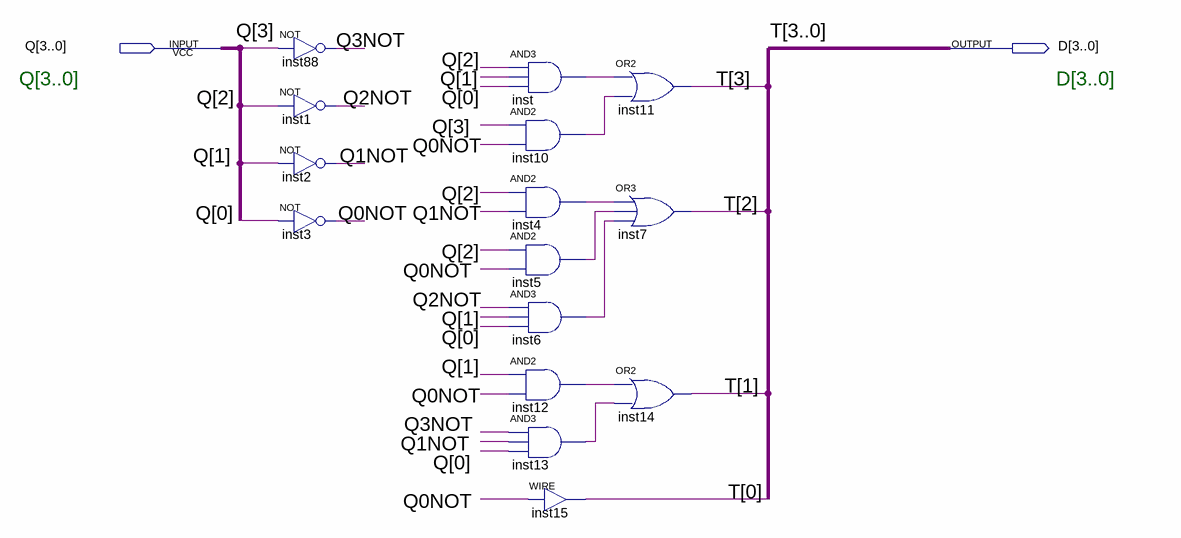
[diagram p0: schematic sheet]
// Quartus schematic TTKT.bdf as structural Verilog: 15 symbols, 2 pins
module TTKT (
  input  [3:0] Q,
  output [3:0] D
);

  wire inst4_out, inst5_out, inst6_out, inst10_out, inst12_out, inst13_out, inst_out, Q0NOT, Q1NOT, Q2NOT,
       Q3NOT;

  not inst88 (Q3NOT, Q[3]);
  not inst1 (Q2NOT, Q[2]);
  not inst2 (Q1NOT, Q[1]);
  not inst3 (Q0NOT, Q[0]);
  and inst (inst_out, Q[2], Q[1], Q[0]);
  and inst10 (inst10_out, Q[3], Q0NOT);
  and inst4 (inst4_out, Q[2], Q1NOT);
  and inst5 (inst5_out, Q[2], Q0NOT);
  and inst6 (inst6_out, Q2NOT, Q[1], Q[0]);
  and inst12 (inst12_out, Q[1], Q0NOT);
  and inst13 (inst13_out, Q3NOT, Q1NOT, Q[0]);
  assign D[0] = Q0NOT;  // WIRE inst15
  or inst11 (D[3], inst_out, inst10_out);
  or inst7 (D[2], inst4_out, inst5_out, inst6_out);
  or inst14 (D[1], inst12_out, inst13_out);

  // Other names for the same wires on the sheet: T[3:0] = D

  // Notes on the sheet:
  //   Q[3..0]
  //   D[3..0]
endmodule
